# Altium schematic sheet STM32F1Debugger.SchDoc
size A4
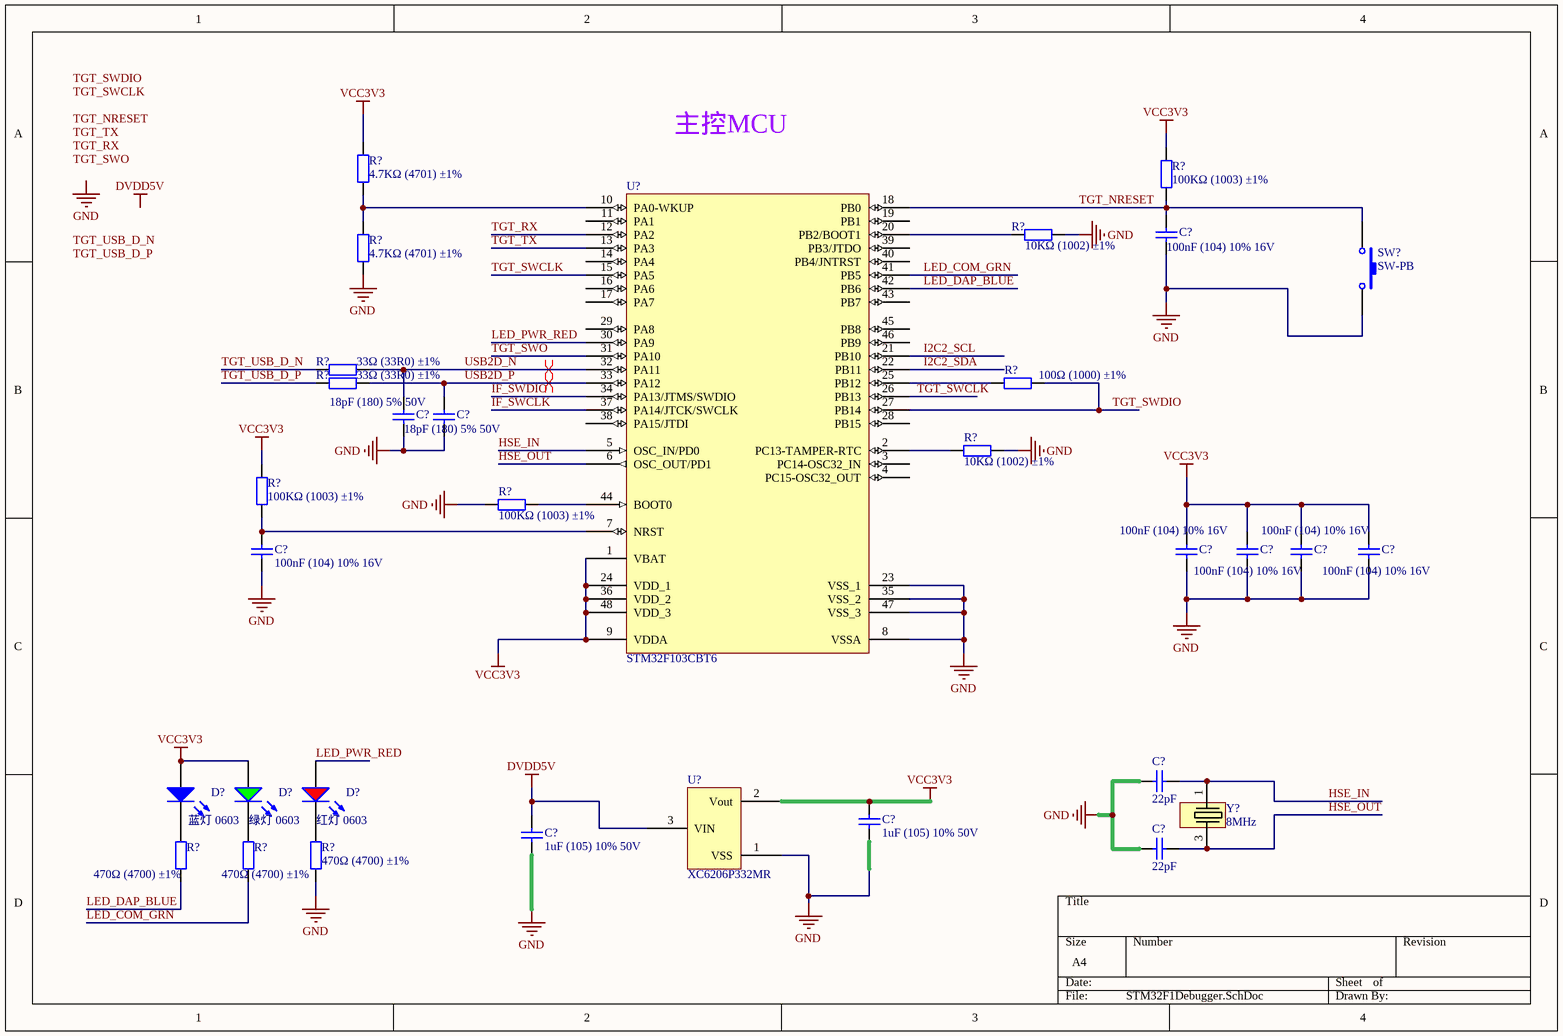
[diagram p0: STM32F1Debugger.SchDoc]

## Parts
(Parts that share a designator on the sheet are numbered #1, #2 ... from top to bottom, then left to right.)
C?#1  100nF (104) 10% 16V  [0402_C]
C?#2  18pF (180) 5% 50V  [0402_C]
C?#3  18pF (180) 5% 50V  [0402_C]
C?#4  100nF (104) 10% 16V  [0402_C]
C?#5  100nF (104) 10% 16V  [0402_C]
C?#6  100nF (104) 10% 16V  [0402_C]
C?#7  100nF (104) 10% 16V  [0402_C]
C?#8  100nF (104) 10% 16V  [0402_C]
C?#9  22pF  [0603_C]
C?#10  22pF  [0603_C]
C?#11  1uF (105) 10% 50V  [0603_C]
C?#12  1uF (105) 10% 50V  [0603_C]
D?#1  蓝灯 0603  [0603_LED_S1]
D?#2  绿灯 0603  [0603_LED_S1]
D?#3  红灯 0603  [0603_LED_S1]
R?#1  4.7KΩ (4701) ±1%  [0402_R]
R?#2  100KΩ (1003) ±1%  [0402_R]
R?#3  10KΩ (1002) ±1%  [0402_R]
R?#4  4.7KΩ (4701) ±1%  [0402_R]
R?#5  33Ω (33R0) ±1%  [0402_R]
R?#6  33Ω (33R0) ±1%  [0402_R]
R?#7  100Ω (1000) ±1%  [0402_R]
R?#8  10KΩ (1002) ±1%  [0402_R]
R?#9  100KΩ (1003) ±1%  [0402_R]
R?#10  100KΩ (1003) ±1%  [0402_R]
R?#11  470Ω (4700) ±1%  [0402_R]
R?#12  470Ω (4700) ±1%  [0402_R]
R?#13  470Ω (4700) ±1%  [0402_R]
SW?  SW-PB  [PB_TYCO_FSMSM]
U?#1  STM32F103CBT6  [STM32F103CBT6-Footprint-1]
U?#2  XC6206P332MR  [SOT95P245X110-3N]
Y?  8MHz  [OSC_SI-TIME_SIT1602-2]

## Nets
DVDD5V: C?#12.2 U?#2.3(VIN)
GND: C?#1.1 C?#2.1 C?#3.1 C?#4.1 C?#5.1 C?#6.1 C?#7.1 C?#8.1 C?#9.1 C?#10.1 C?#11.1 C?#12.1 R?#3.2 R?#4.1 R?#8.2 R?#10.2 R?#13.1 SW?.2 U?#1.8(VSSA) U?#1.23(VSS_1) U?#1.35(VSS_2) U?#1.47(VSS_3) U?#2.1(VSS)
VCC3V3: C?#5.2 C?#6.2 C?#7.2 C?#8.2 C?#11.2 D?#1.A D?#2.A R?#1.2 R?#2.2 R?#9.2 U?#1.1(VBAT) U?#1.9(VDDA) U?#1.24(VDD_1) U?#1.36(VDD_2) U?#1.48(VDD_3) U?#2.2(Vout)
HSE_IN: C?#9.2 U?#1.5(OSC_IN/PD0) Y?.1
HSE_OUT: C?#10.2 U?#1.6(OSC_OUT/PD1) Y?.3
I2C2_SCL: U?#1.21(PB10)
I2C2_SDA: U?#1.22(PB11)
IF_SWCLK: U?#1.37(PA14/JTCK/SWCLK)
IF_SWDIO: U?#1.34(PA13/JTMS/SWDIO)
LED_COM_GRN: R?#12.1 U?#1.41(PB5)
LED_DAP_BLUE: R?#11.1 U?#1.42(PB6)
LED_PWR_RED: D?#3.A U?#1.30(PA9)
TGT_NRESET: C?#1.2 R?#2.1 SW?.1 U?#1.18(PB0)
TGT_RX: U?#1.12(PA2)
TGT_SWCLK: U?#1.15(PA5) U?#1.26(PB13)
TGT_SWDIO: R?#7.2 U?#1.27(PB14)
TGT_SWO: U?#1.31(PA10)
TGT_TX: U?#1.13(PA3)
TGT_USB_D_N: R?#5.1
TGT_USB_D_P: R?#6.1
USB2D_N: C?#2.2 R?#5.2 U?#1.32(PA11)
USB2D_P: C?#3.2 R?#6.2 U?#1.33(PA12)
NetC?#4_2: C?#4.2 R?#9.1 U?#1.7(NRST)
NetD?#1_K: D?#1.K R?#11.2
NetD?#2_K: D?#2.K R?#12.2
NetD?#3_K: D?#3.K R?#13.2
NetR?#1_1: R?#1.1 R?#4.2 U?#1.10(PA0-WKUP)
NetR?#3_1: R?#3.1 U?#1.20(PB2/BOOT1)
NetR?#7_1: R?#7.1 U?#1.25(PB12)
NetR?#8_1: R?#8.1 U?#1.2(PC13-TAMPER-RTC)
NetR?#10_1: R?#10.1 U?#1.44(BOOT0)

Not connected (* = marked no-connect by the designer): U?#1 3(PC14-OSC32_IN) 4(PC15-OSC32_OUT) 11(PA1) 14(PA4) 16(PA6) 17(PA7) 19(PB1) 28(PB15) 29(PA8) 38(PA15/JTDI) 39(PB3/JTDO) 40(PB4/JNTRST) 43(PB7) 45(PB8) 46(PB9); Y? 2(GND) 4(GND)

## Layout directives
differential pair; differential pair class USB2Diff: USB2D_N, USB2D_P

## Notes on the sheet
- 主控MCU
- Labels drawn without touching a wire or pin: DVDD5V, GND, TGT_NRESET, TGT_RX, TGT_SWCLK, TGT_SWDIO, TGT_SWO, TGT_TX, TGT_USB_D_N, TGT_USB_D_P

## Library data of the parts
C?#1 C?#4-C?#8 = 0402 100nF (104) 10% 16V: 贴片电容; ComponentLink1Description: 供应商链接; ComponentLink1URL: http://www.szlcsc.com/product/details_1877.html; Package: 0402; Supplier: LC; SuppliersPartNumber: C1525
C?#2 C?#3 = 0402 18pF (180) 5% 50V: 贴片电容; ComponentLink1Description: 供应商链接; ComponentLink1URL: http://www.szlcsc.com/product/details_1901.html; Package: 0402; Supplier: LC; SuppliersPartNumber: C1549
C?#9 C?#10 = Cap: Capacitor; Published: 8-Jun-2000; LatestRevisionDate: 17-Jul-2002; LatestRevisionNote: Re-released for DXP Platform.; PackageReference: RAD-0.3; Publisher: Altium Limited; Value: 22pF
C?#11 C?#12 = 0603 1uF (105) 10% 50V: 贴片电容; ComponentLink1Description: 供应商链接; ComponentLink1URL: http://www.szlcsc.com/product/details_16531.html; Package: 0603; Supplier: LC; SuppliersPartNumber: C15849
D?#1 = 0603 蓝灯: 发光二极管; ComponentLink1Description: 供应商链接; ComponentLink1URL: http://www.szlcsc.com/product/details_73150.html; Package: 0603; Supplier: LC; SuppliersPartNumber: C72041
D?#2 = 0603 绿灯: 发光二极管; ComponentLink1Description: 供应商链接; ComponentLink1URL: http://www.szlcsc.com/product/details_73152.html; Package: 0603; Supplier: LC; SuppliersPartNumber: C72043
D?#3 = 0603 红灯: 发光二极管; ComponentLink1Description: 供应商链接; ComponentLink1URL: http://www.szlcsc.com/product/details_2659.html; Package: 0603; Supplier: LC; SuppliersPartNumber: C2286
R?#1 R?#4 = 0402 4.7KΩ (4701) 1%: 贴片电阻; ComponentLink1Description: 供应商链接; ComponentLink1URL: http://www.szlcsc.com/product/details_26643.html; Package: 0402; Supplier: LC; SuppliersPartNumber: C25900
R?#2 R?#9 R?#10 = 0402 100KΩ (1003) 1%: 贴片电阻; ComponentLink1Description: 供应商链接; ComponentLink1URL: http://www.szlcsc.com/product/details_26484.html; Package: 0402; Supplier: LC; SuppliersPartNumber: C25741
R?#3 R?#8 = 0402 10KΩ (1002) 1%: 贴片电阻; ComponentLink1Description: 供应商链接; ComponentLink1URL: http://www.szlcsc.com/product/details_26487.html; Package: 0402; Supplier: LC; SuppliersPartNumber: C25744
R?#5 R?#6 = 0402 33Ω (33R0) 1%: 贴片电阻; ComponentLink1Description: 供应商链接; ComponentLink1URL: http://www.szlcsc.com/product/details_25848.html; Package: 0402; Supplier: LC; SuppliersPartNumber: C25105
R?#7 = 0402 100Ω (1000) 1%: 贴片电阻; ComponentLink1Description: 供应商链接; ComponentLink1URL: http://www.szlcsc.com/product/details_25819.html; Package: 0402; Supplier: LC; SuppliersPartNumber: C25076
R?#11-R?#13 = 0402 470Ω (4700) 1%: 贴片电阻; ComponentLink1Description: 供应商链接; ComponentLink1URL: http://www.szlcsc.com/product/details_25860.html; Package: 0402; Supplier: LC; SuppliersPartNumber: C25117
SW? = SW-PB: Switch; Published: 24-Mar-1999; LatestRevisionDate: 17-Jul-2002; LatestRevisionNote: Re-released for DXP Platform.; PackageReference: SPST-2; Publisher: Altium Limited; PackageDescription: Switch; 2 Leads
U?#1 = CMP-020-00023-1: ARM® 32-bit Cortex®-M3 CPU Core,72 MHz maximum frequency; RAM Size: 64 or 128 Kbytes of Flash memory, 20 Kbytes of SRAM; Pins: 48; Case/Package: LQFP48
U?#2 = CMP-019-00049-1: 低压差线性稳压(LDO),最大输入8V，输出电流100mA; Max Supply Voltage: 8V; Output Voltage: 3.3V; Pins: 3; Max Operating Temperature: 80°C; Case/Package: SOT-23; Min Operating Temperature: -25°C
Y? = XTAL-4: VALUE: 8MHz